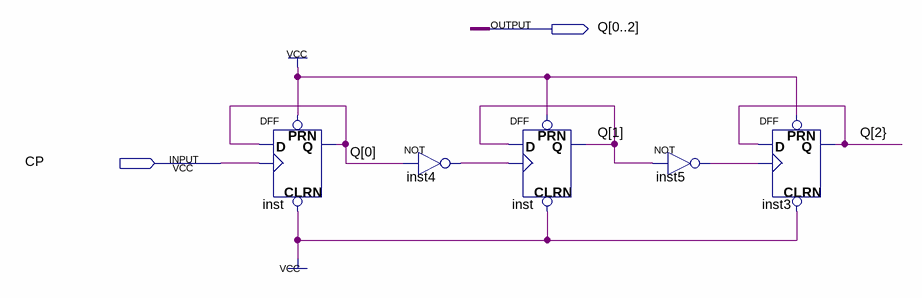
[diagram p0: schematic sheet]
// Quartus schematic binary.bdf as structural Verilog: 5 symbols, 2 pins
module binary (
  input  CP,
  output [0:2] Q
);

  wire inst4_out, inst5_out, \Q[2} ;

  DFF inst (.CLRN(1'b1), .CLK(CP), .D(Q[0]), .PRN(1'b1), .Q(Q[0]));
  not inst4 (inst4_out, Q[0]);
  DFF inst_dup2 (.CLRN(1'b1), .CLK(inst4_out), .D(Q[1]), .PRN(1'b1), .Q(Q[1]));
  not inst5 (inst5_out, Q[1]);
  DFF inst3 (.CLRN(1'b1), .CLK(inst5_out), .D(\Q[2} ), .PRN(1'b1), .Q(\Q[2} ));
endmodule
